# EAGLE design UPX_Port_Adapter (EAGLE 9.6.2)
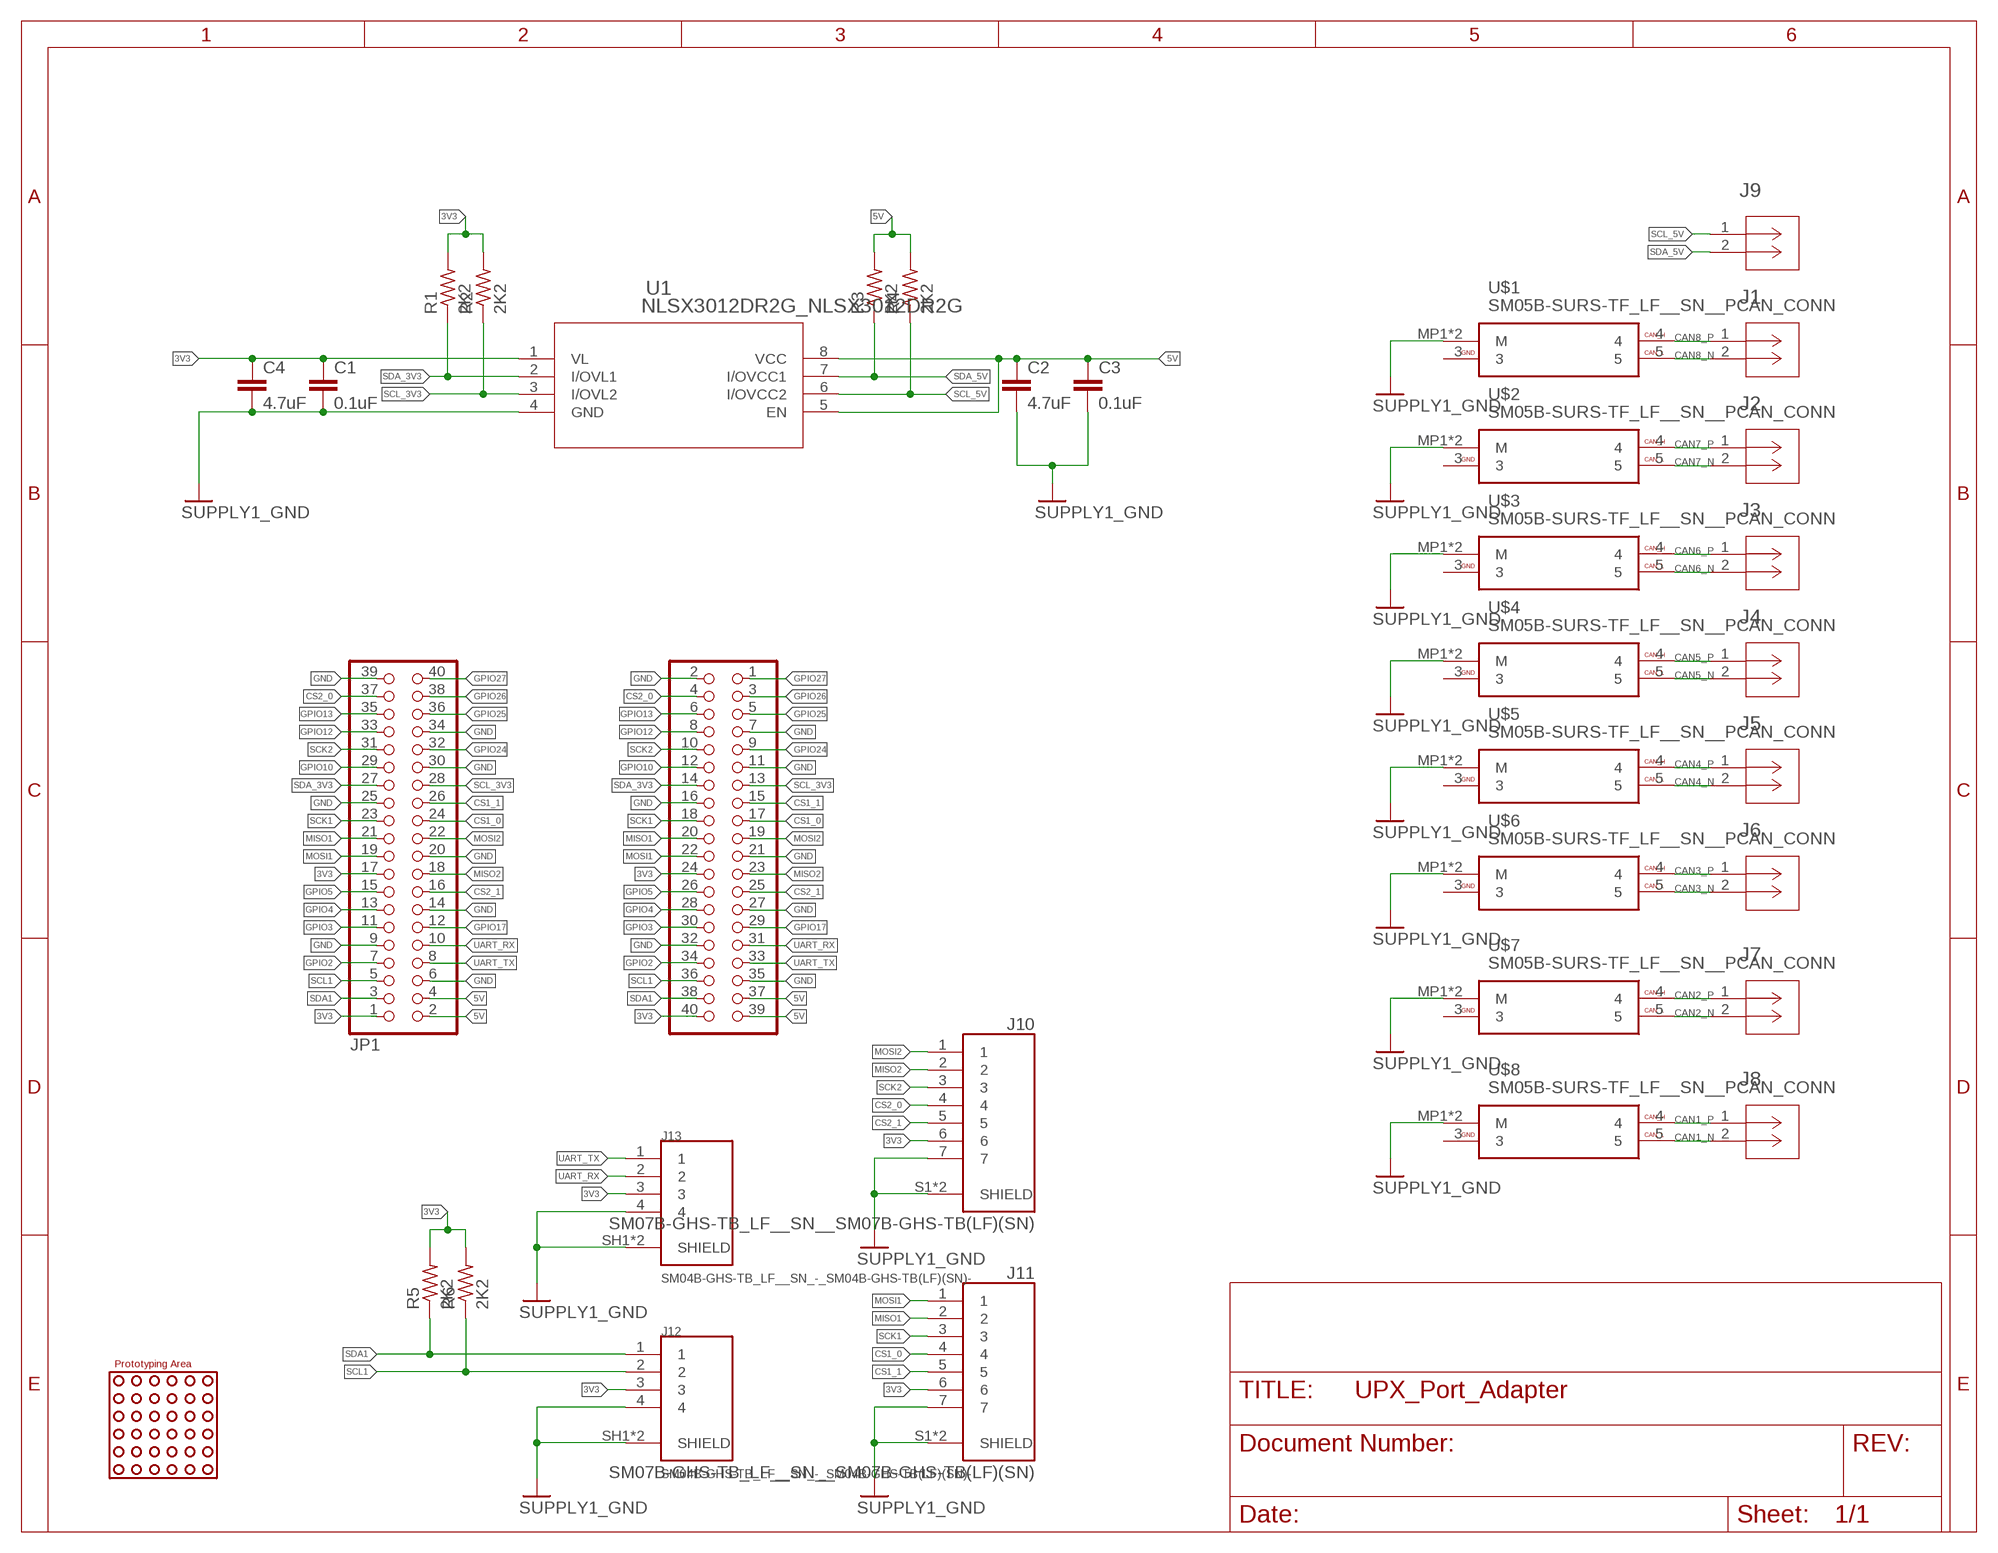
[diagram p0: schematic, sheet 1]

## Parts
C1  0.1uF  RCL_C-EUC0603  [RCL_C0603]
C2  4.7uF  RCL_C-EUC0603  [RCL_C0603]
C3  0.1uF  RCL_C-EUC0603  [RCL_C0603]
C4  4.7uF  RCL_C-EUC0603  [RCL_C0603]
J1  SM02B-GHS-TB_SM02BGHSTBLFSN  [SM02B-GHS-TB_CONN_SM02BGHSTB_JST]
J2  SM02B-GHS-TB_SM02BGHSTBLFSN  [SM02B-GHS-TB_CONN_SM02BGHSTB_JST]
J3  SM02B-GHS-TB_SM02BGHSTBLFSN  [SM02B-GHS-TB_CONN_SM02BGHSTB_JST]
J4  SM02B-GHS-TB_SM02BGHSTBLFSN  [SM02B-GHS-TB_CONN_SM02BGHSTB_JST]
J5  SM02B-GHS-TB_SM02BGHSTBLFSN  [SM02B-GHS-TB_CONN_SM02BGHSTB_JST]
J6  SM02B-GHS-TB_SM02BGHSTBLFSN  [SM02B-GHS-TB_CONN_SM02BGHSTB_JST]
J7  SM02B-GHS-TB_SM02BGHSTBLFSN  [SM02B-GHS-TB_CONN_SM02BGHSTB_JST]
J8  SM02B-GHS-TB_SM02BGHSTBLFSN  [SM02B-GHS-TB_CONN_SM02BGHSTB_JST]
J9  SM02B-GHS-TB_SM02BGHSTBLFSN  [SM02B-GHS-TB_CONN_SM02BGHSTB_JST]
J10  SM07B-GHS-TB_LF__SN__SM07B-GHS-TB(LF)(SN)  [SM07B-GHS-TB_LF__SN__JST_SM07B-GHS-TB(LF)(SN)]
J11  SM07B-GHS-TB_LF__SN__SM07B-GHS-TB(LF)(SN)  [SM07B-GHS-TB_LF__SN__JST_SM07B-GHS-TB(LF)(SN)]
J12  SM04B-GHS-TB_LF__SN_-_SM04B-GHS-TB(LF)(SN)-  [SM04B-GHS-TB_LF__SN_-_JST_SM04B-GHS-TB(LF)(SN)-]
J13  SM04B-GHS-TB_LF__SN_-_SM04B-GHS-TB(LF)(SN)-  [SM04B-GHS-TB_LF__SN_-_JST_SM04B-GHS-TB(LF)(SN)-]
JP1  PINHEAD_PINHD-2X20  [PINHEAD_2X20]
JP2  PINHEAD2_PINHD-2X20/90:1  [PINHEAD2_2X20/90]
R1  2K2  RCL_R-US_R0603  [RCL_R0603]
R2  2K2  RCL_R-US_R0603  [RCL_R0603]
R3  2K2  RCL_R-US_R0603  [RCL_R0603]
R4  2K2  RCL_R-US_R0603  [RCL_R0603]
R5  2K2  RCL_R-US_R0603  [RCL_R0603]
R6  2K2  RCL_R-US_R0603  [RCL_R0603]
U1  NLSX3012DR2G_NLSX3012DR2G  [NLSX3012DR2G_SOIC-8_NB_ONS]
U$1  SM05B-SURS-TF_LF__SN__PCAN_CONN  [SM05B-SURS-TF_LF__SN__SM05BSURSTFLFSN]
U$2  SM05B-SURS-TF_LF__SN__PCAN_CONN  [SM05B-SURS-TF_LF__SN__SM05BSURSTFLFSN]
U$3  SM05B-SURS-TF_LF__SN__PCAN_CONN  [SM05B-SURS-TF_LF__SN__SM05BSURSTFLFSN]
U$4  SM05B-SURS-TF_LF__SN__PCAN_CONN  [SM05B-SURS-TF_LF__SN__SM05BSURSTFLFSN]
U$5  SM05B-SURS-TF_LF__SN__PCAN_CONN  [SM05B-SURS-TF_LF__SN__SM05BSURSTFLFSN]
U$6  SM05B-SURS-TF_LF__SN__PCAN_CONN  [SM05B-SURS-TF_LF__SN__SM05BSURSTFLFSN]
U$7  SM05B-SURS-TF_LF__SN__PCAN_CONN  [SM05B-SURS-TF_LF__SN__SM05BSURSTFLFSN]
U$8  SM05B-SURS-TF_LF__SN__PCAN_CONN  [SM05B-SURS-TF_LF__SN__SM05BSURSTFLFSN]
U$9  PINHEAD-CUSTOM_20X20  [PINHEAD-CUSTOM_20X20]

## Nets
3V3: C1.1 C4.1 J10.6 J11.6 J12.3 J13.3 JP1.1 JP1.17 JP2.24 JP2.40 R1.2 R2.2 R5.2 R6.2 U1.1(VL)
5V: C2.1 C3.1 JP1.2 JP1.4 JP2.37 JP2.39 R3.2 R4.2 U1.5(EN) U1.8(VCC)
CAN1_N [CAN]: J8.2 U$8.5
CAN1_P [CAN]: J8.1 U$8.4
CAN2_N [CAN]: J7.2 U$7.5
CAN2_P [CAN]: J7.1 U$7.4
CAN3_N [CAN]: J6.2 U$6.5
CAN3_P [CAN]: J6.1 U$6.4
CAN4_N [CAN]: J5.2 U$5.5
CAN4_P [CAN]: J5.1 U$5.4
CAN5_N [CAN]: J4.2 U$4.5
CAN5_P [CAN]: J4.1 U$4.4
CAN6_N [CAN]: J3.2 U$3.5
CAN6_P [CAN]: J3.1 U$3.4
CAN7_N [CAN]: J2.2 U$2.5
CAN7_P [CAN]: J2.1 U$2.4
CAN8_N [CAN]: J1.2 U$1.5
CAN8_P [CAN]: J1.1 U$1.4
CS1_0: J11.4 JP1.24 JP2.17
CS1_1: J11.5 JP1.26 JP2.15
CS2_0: J10.4 JP1.37 JP2.4
CS2_1: J10.5 JP1.16 JP2.25
GND: C1.2 C2.2 C3.2 C4.2 J10.7 J10.S1(SHIELD) J10.S2(SHIELD) J11.7 J11.S1(SHIELD) J11.S2(SHIELD) J12.4 J12.SH1(SHIELD) J12.SH2(SHIELD) J13.4 J13.SH1(SHIELD) J13.SH2(SHIELD) JP1.6 JP1.9 JP1.14 JP1.20 JP1.25 JP1.30 JP1.34 JP1.39 JP2.2 JP2.7 JP2.11 JP2.16 JP2.21 JP2.27 JP2.32 JP2.35 U1.4(GND) U$1.MP1(M) U$1.MP2(M) U$2.MP1(M) U$2.MP2(M) U$3.MP1(M) U$3.MP2(M) U$4.MP1(M) U$4.MP2(M) U$5.MP1(M) U$5.MP2(M) U$6.MP1(M) U$6.MP2(M) U$7.MP1(M) U$7.MP2(M) U$8.MP1(M) U$8.MP2(M) ; supply symbol labelled SUPPLY1_GND
GPIO2: JP1.7 JP2.34
GPIO3: JP1.11 JP2.30
GPIO4: JP1.13 JP2.28
GPIO5: JP1.15 JP2.26
GPIO10: JP1.29 JP2.12
GPIO12: JP1.33 JP2.8
GPIO13: JP1.35 JP2.6
GPIO17: JP1.12 JP2.29
GPIO24: JP1.32 JP2.9
GPIO25: JP1.36 JP2.5
GPIO26: JP1.38 JP2.3
GPIO27: JP1.40 JP2.1
MISO1: J11.2 JP1.21 JP2.20
MISO2: J10.2 JP1.18 JP2.23
MOSI1: J11.1 JP1.19 JP2.22
MOSI2: J10.1 JP1.22 JP2.19
SCK1: J11.3 JP1.23 JP2.18
SCK2: J10.3 JP1.31 JP2.10
SCL1: J12.2 JP1.5 JP2.36 R6.1
SCL_3V3: JP1.28 JP2.13 R2.1 U1.3(I/OVL2)
SCL_5V: J9.1 R4.1 U1.6(I/OVCC2)
SDA1: J12.1 JP1.3 JP2.38 R5.1
SDA_3V3: JP1.27 JP2.14 R1.1 U1.2(I/OVL1)
SDA_5V: J9.2 R3.1 U1.7(I/OVCC1)
UART_RX: J13.2 JP1.10 JP2.31
UART_TX: J13.1 JP1.8 JP2.33
Unconnected: U$1.3 U$2.3 U$3.3 U$4.3 U$5.3 U$6.3 U$7.3 U$8.3

## Library data of the parts
C1-C4 = UPX_Port_Adapter:RCL_C-EU: CAPACITOR, European symbol; SPICEPREFIX: C
J1-J9 = UPX_Port_Adapter:SM02B-GHS-TB_SM02BGHSTBLFSN; COPYRIGHT: Copyright (C) 2022 Ultra Librarian. All rights reserved.; DIGI-KEY_PART_NUMBER_1: 455-1564-2-ND; DIGI-KEY_PART_NUMBER_2: 455-1564-1-ND; DIGI-KEY_PART_NUMBER_3: 455-1564-6-ND; MANUFACTURER_PART_NUMBER: SM02BGHSTBLFSN; MFR_NAME: JST
J10 J11 = UPX_Port_Adapter:SM07B-GHS-TB_LF__SN__SM07B-GHS-TB(LF)(SN): Conn Shrouded Header HDR 7 POS 1.25mm Solder RA SMD Reel; DESCRIPTION: Connector Header Surface Mount, Right Angle 7 position 0.049 (1.25mm); DIGI-KEY_PART_NUMBER: 455-1569-2-ND; MF: JST Sales; MP: SM07B-GHS-TB(LF)(SN); PACKAGE: None; PURCHASE-URL: https://pricing.snapeda.com/search/part/SM07B-GHS-TB(LF)(SN)/?ref=eda
J12 J13 = UPX_Port_Adapter:SM04B-GHS-TB_LF__SN_-_SM04B-GHS-TB(LF)(SN)-: Conn Header Gh Side 4pos 1.25mm; DESCRIPTION: Connector Header Surface Mount, Right Angle 4 position 0.049 (1.25mm); DIGI-KEY_PART_NUMBER: 455-1566-2-ND; MF: JST Sales; MP: SM04B-GHS-TB(LF)(SN)-; PACKAGE: None; PURCHASE-URL: https://pricing.snapeda.com/search/part/SM04B-GHS-TB(LF)(SN)-/?ref=eda
JP1 = UPX_Port_Adapter:PINHEAD_PINHD-2X20: PIN HEADER
JP2 = UPX_Port_Adapter:PINHEAD2_PINHD-2X20*?:1: PIN HEADER
R1-R6 = UPX_Port_Adapter:RCL_R-US_: RESISTOR, American symbol; SPICEPREFIX: R
U1 = UPX_Port_Adapter:NLSX3012DR2G_NLSX3012DR2G; COPYRIGHT: Copyright (C) 2022 Ultra Librarian. All rights reserved.; DIGI-KEY_PART_NUMBER_1: 2156-NLSX3012DR2G-OS-ND; DIGI-KEY_PART_NUMBER_2: NLSX3012DR2G-ND; DIGI-KEY_PART_NUMBER_3: NLSX3012DR2GOSCT-ND; DIGI-KEY_PART_NUMBER_4: NLSX3012DR2GOSDKR-ND; DIGI-KEY_PART_NUMBER_5: NLSX3012DR2GOSTR-ND; MANUFACTURER_PART_NUMBER: NLSX3012DR2G; MFR_NAME: onsemi
U$1-U$8 = UPX_Port_Adapter:SM05B-SURS-TF_LF__SN__PCAN_CONN
U$9 = UPX_Port_Adapter:PINHEAD-CUSTOM_20X20

## Net classes
1 CAN: width 0.152 mm, clearance 0.33 mm

## Board
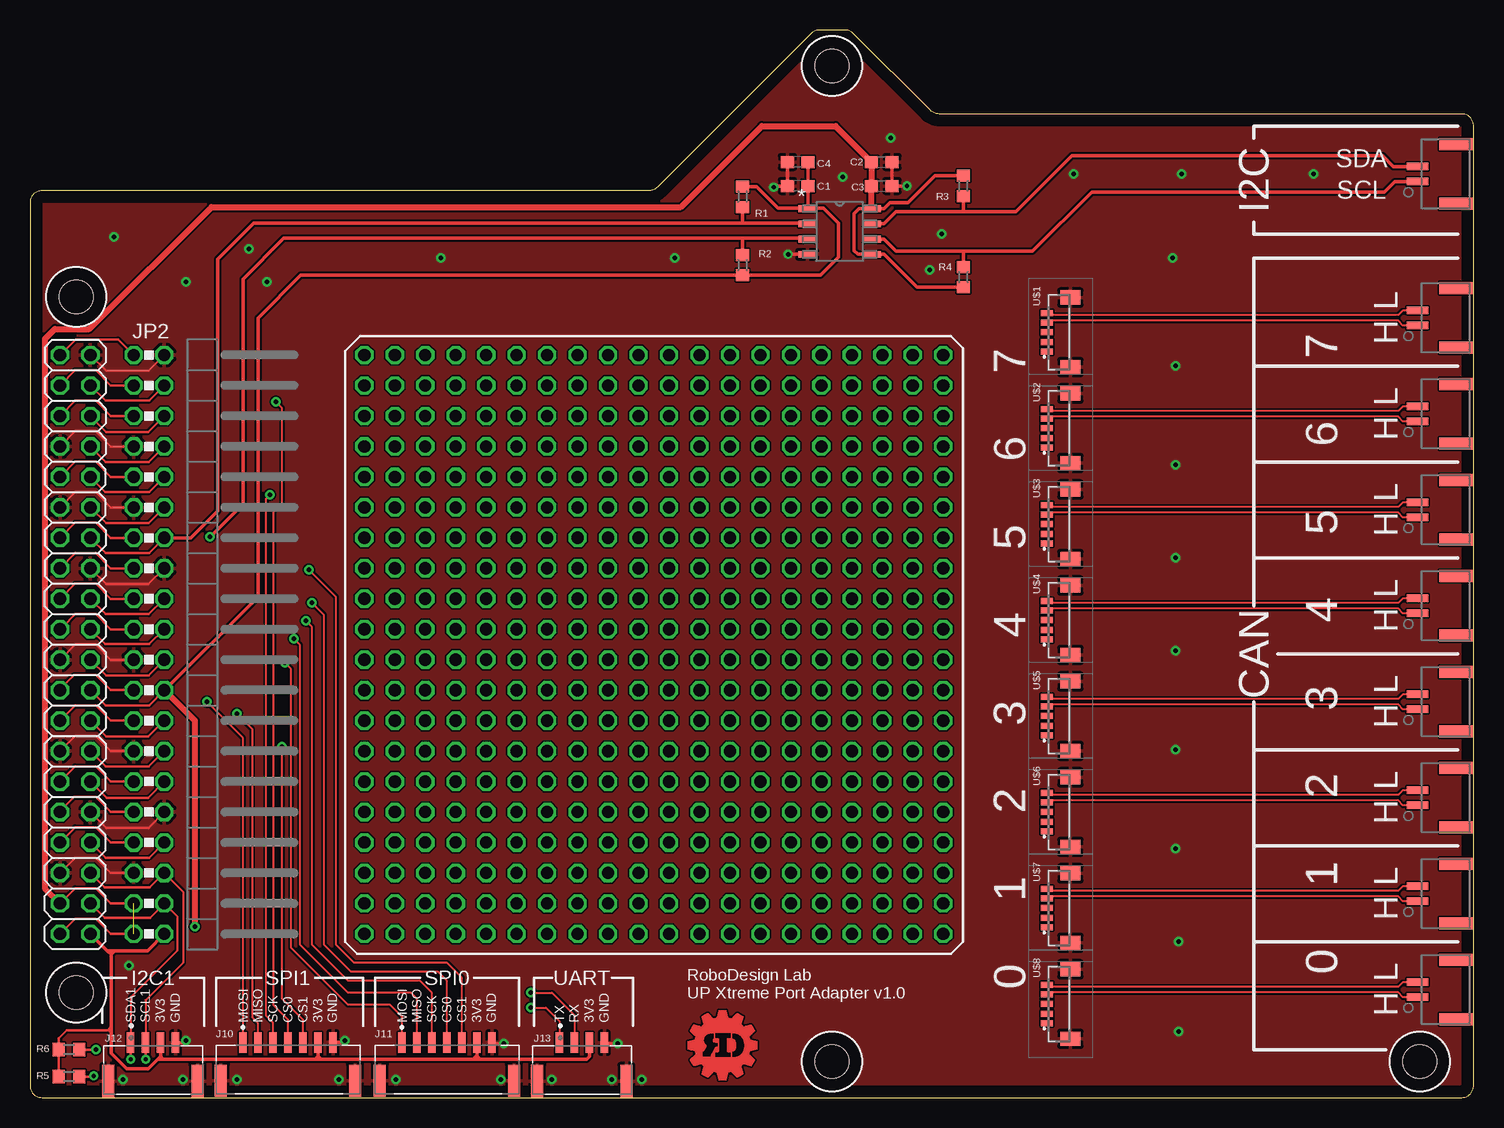
[diagram p1: board, top side]
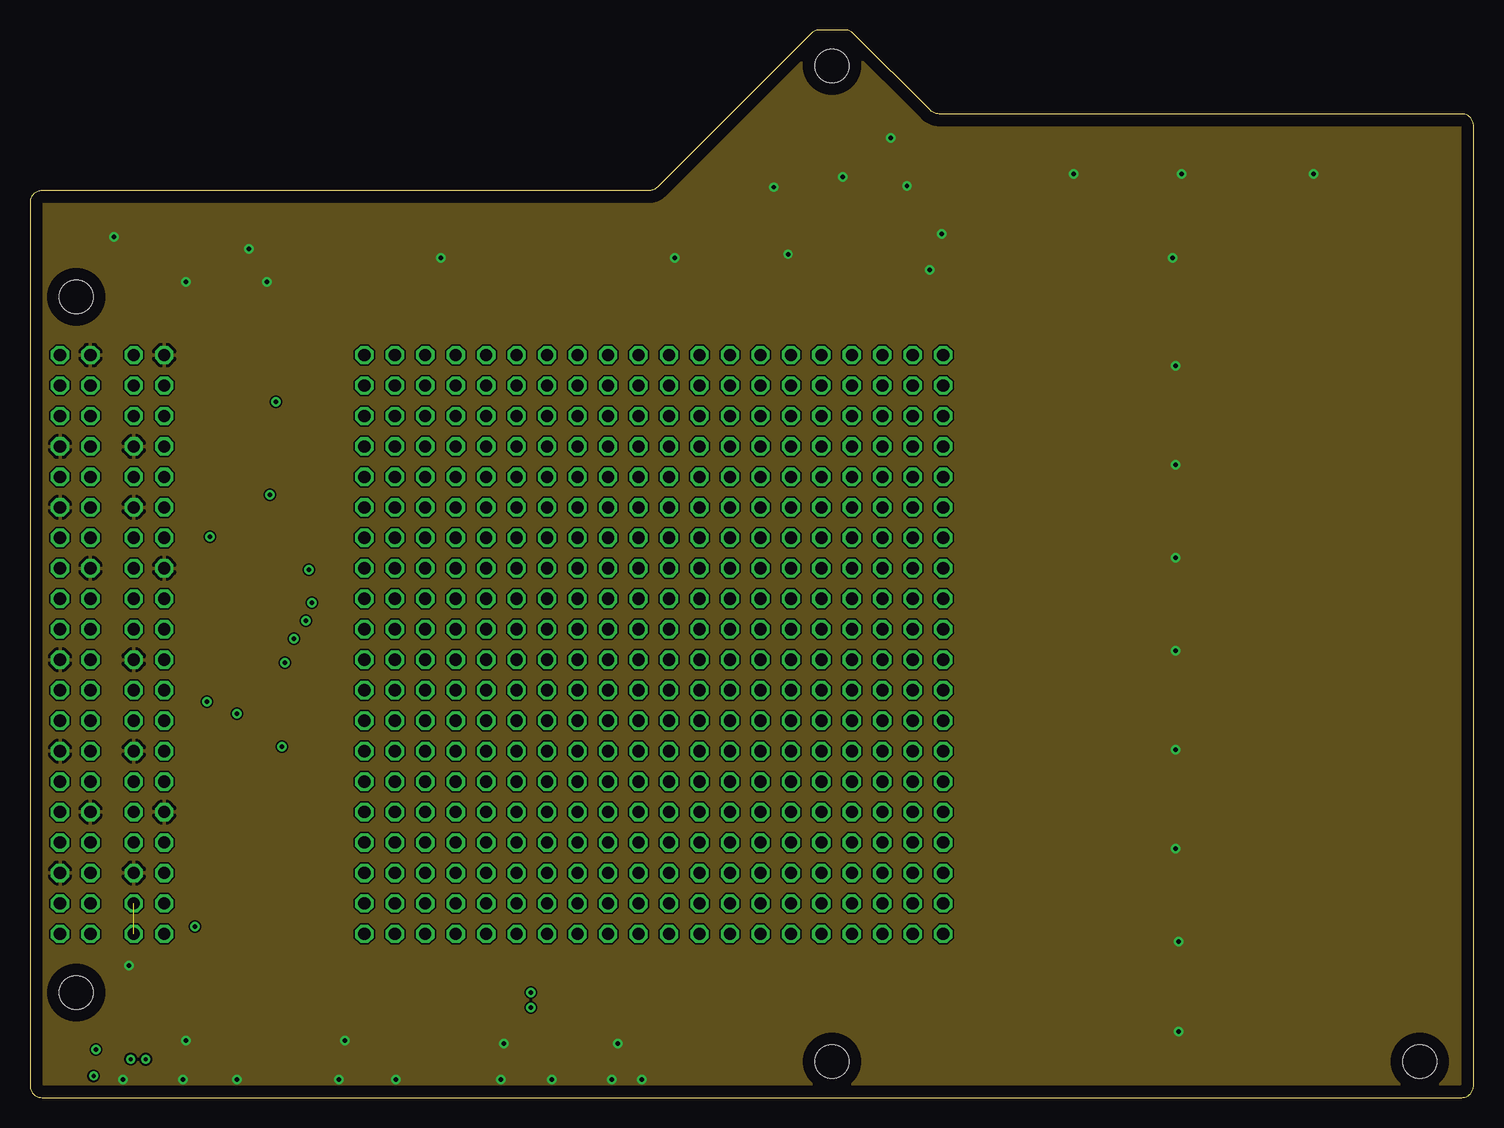
[diagram p2: board, inner layer Route2]
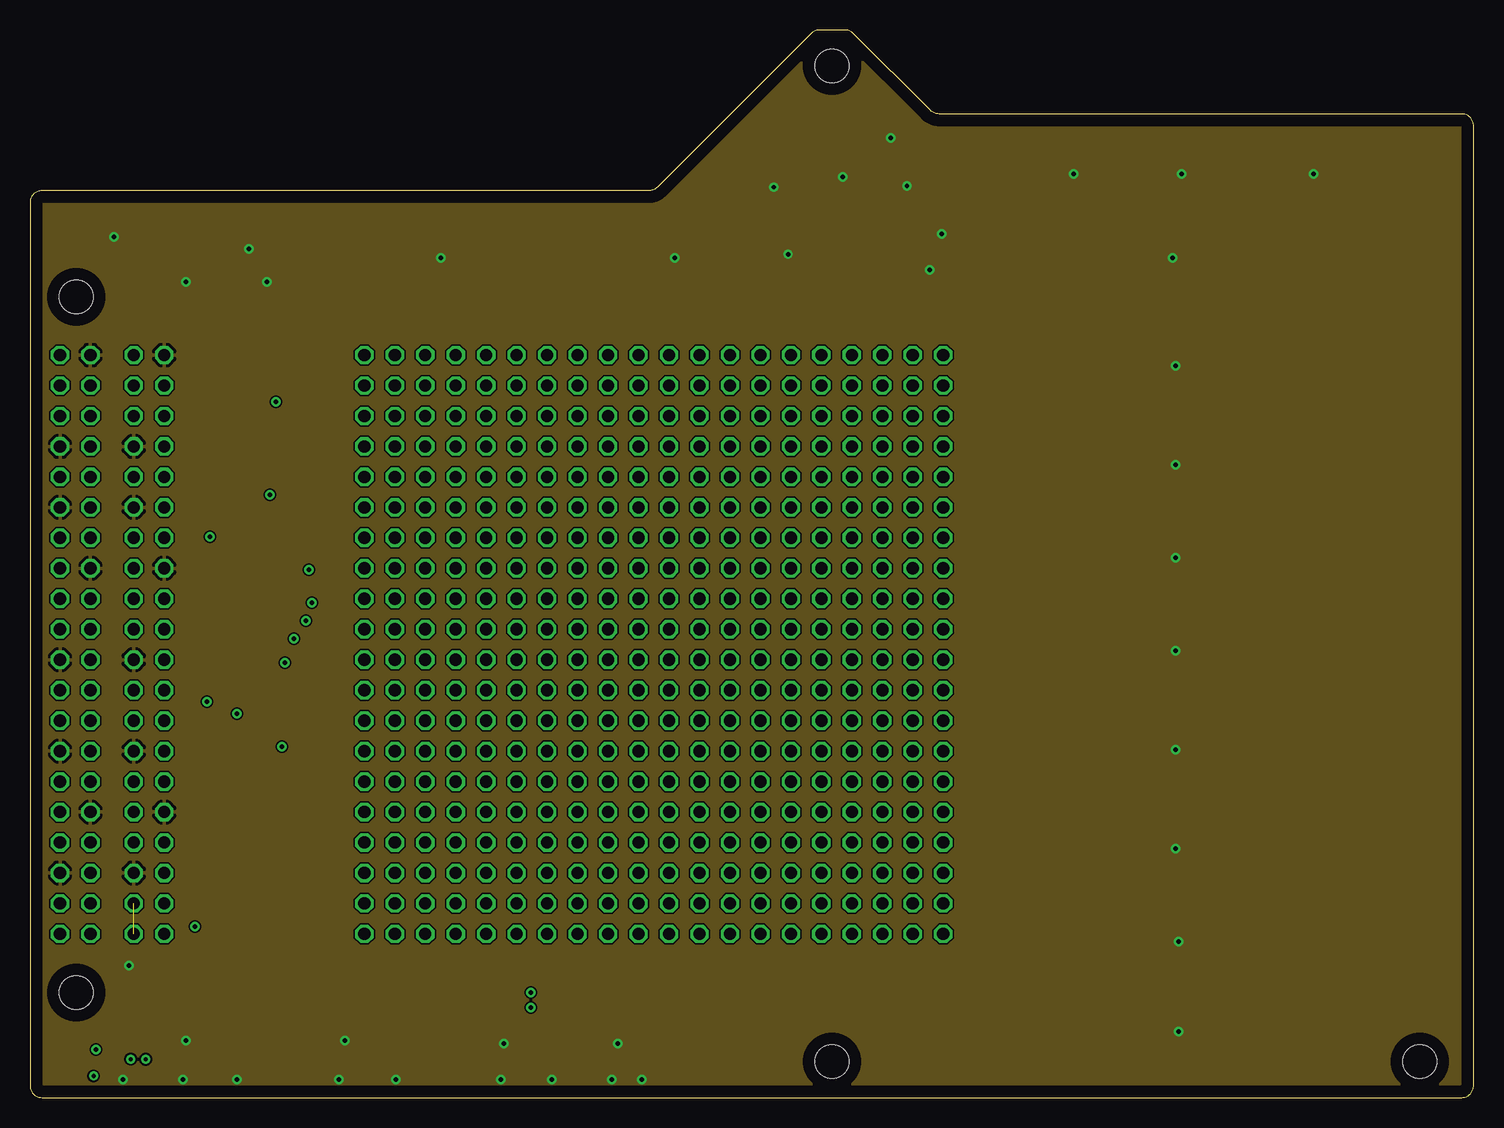
[diagram p3: board, inner layer Route15]
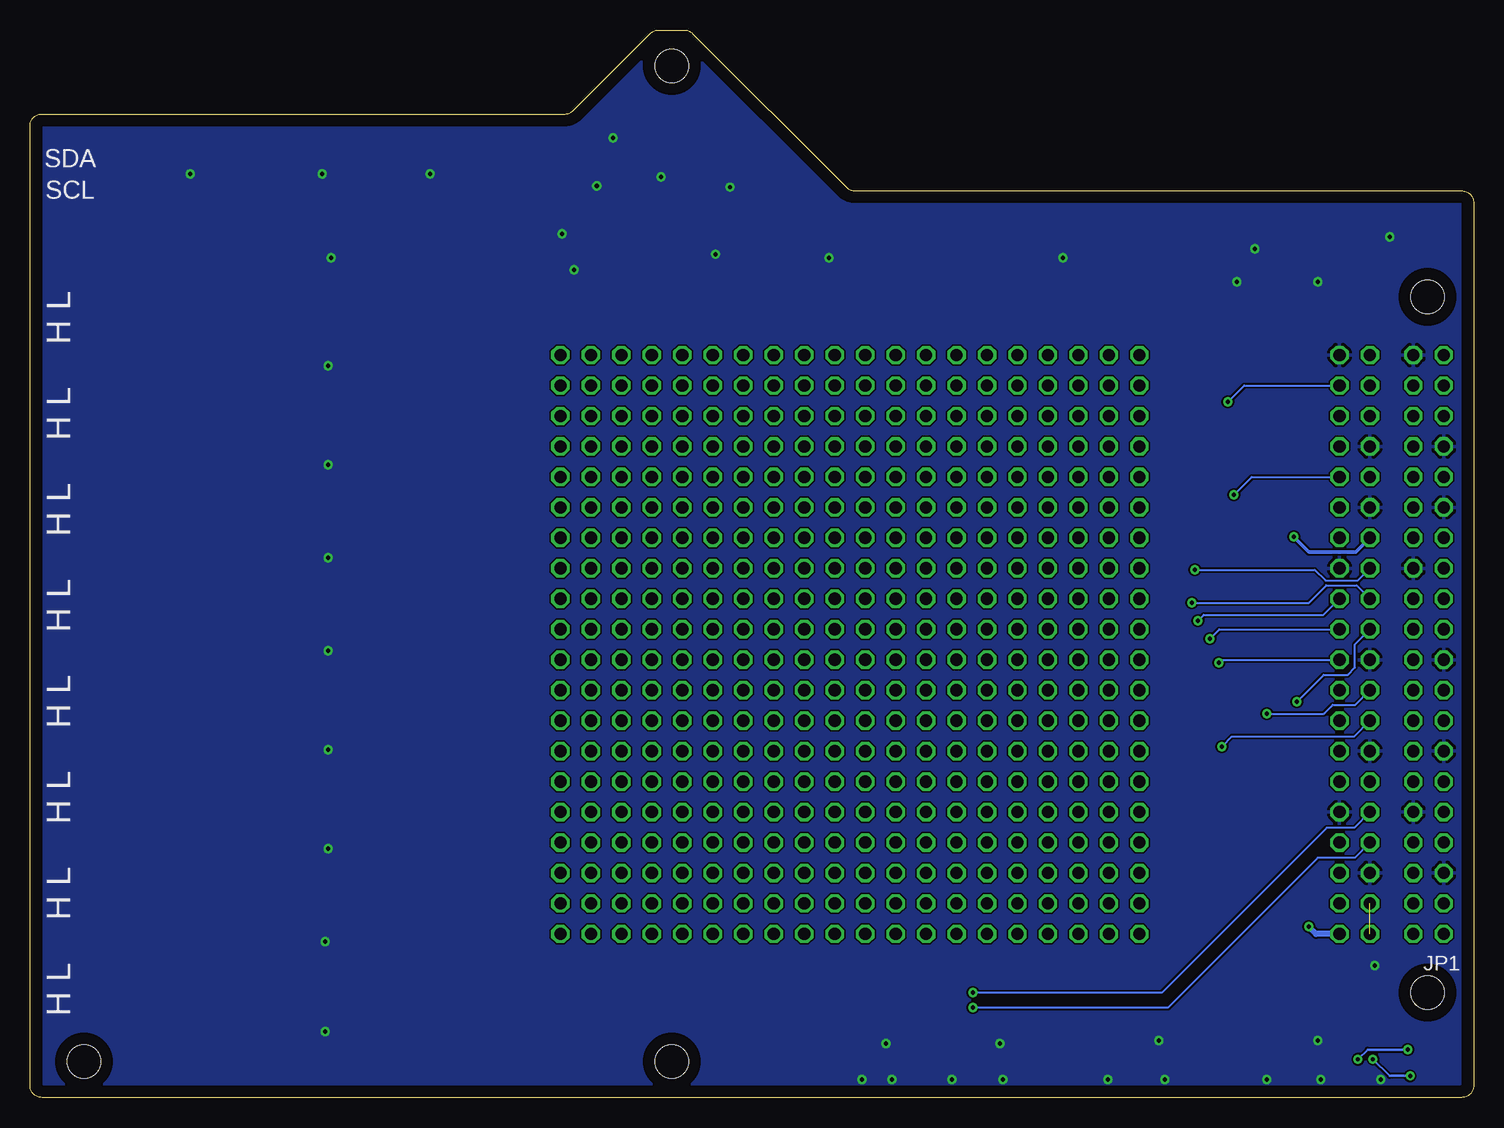
[diagram p4: board, bottom side, seen from below]

Size 120.35 x 89 mm. Coordinates in mm from the lower left corner, seen from the top.
Outline: 119.35,82 75.76,82 arc-45 75.06,82.29 68.64,88.71 arc45 67.94,89 65.81,89 arc45 65.11,88.71 52.29,75.89 arc-45 51.59,75.6 1,75.6 arc90 0,74.6 0,1 arc90 1,0 119.35,0 arc90 120.35,1 120.35,81 arc90 119.35,82
Copper layers (1+2*15+16): Top 0.035mm / dielectric 1.5mm / Route2 0.035mm / dielectric 0.15mm / Route15 0.035mm / dielectric 0.2mm / Bottom 0.035mm
Design rules "default *": minimum track width 6mil, minimum drill 0.35mm, track to track 6mil, track to pad 6mil, pad to pad 6mil, via to via 6mil, smd to smd 6mil, copper to edge 40mil, drill to drill 6mil, minimum pad ring 10mil, minimum via ring 8mil, stop-mask expansion 4mil, vias tented up to drill 20mil, thermal gap 10mil
Holes 2.8 mm at 3.85,8.75 3.85,66.75 115.85,3 66.85,3 66.85,86

### Footprints (pad centres in the part's own frame; a part is rotated, then mirrored left to right if it is on the bottom)
RCL_C0603 = smd 1.1 x 1: 1 -0.85,0; 2 0.85,0
SM02B-GHS-TB_CONN_SM02BGHSTB_JST = smd 0.66 x 1.803: 1 -0.625,2.345; 2 0.625,2.345 | smd 0.991 x 2.794: 3 -2.475,-0.865; 4 2.475,-0.865
SM07B-GHS-TB_LF__SN__JST_SM07B-GHS-TB(LF)(SN) = smd 0.6 x 1.7: 1 -3.75,1.85; 2 -2.5,1.85; 3 -1.25,1.85; 4 0,1.85; 5 1.25,1.85; 6 2.5,1.85; 7 3.75,1.85 | smd 1 x 2.7: S1 5.6,-1.35; S2 -5.6,-1.35
SM04B-GHS-TB_LF__SN_-_JST_SM04B-GHS-TB(LF)(SN)- = smd 0.6 x 1.7: 1 -1.875,2.275; 2 -0.625,2.275; 3 0.625,2.275; 4 1.875,2.275 | smd 1 x 2.7: SH1 -3.725,-0.925; SH2 3.725,-0.925
PINHEAD_2X20 = drill 1.016 octagon: 1 -24.13,-1.27; 2 -24.13,1.27; 3 -21.59,-1.27; 4 -21.59,1.27; 5 -19.05,-1.27; 6 -19.05,1.27; 7 -16.51,-1.27; 8 -16.51,1.27; 9 -13.97,-1.27; 10 -13.97,1.27; 11 -11.43,-1.27; 12 -11.43,1.27; 13 -8.89,-1.27; 14 -8.89,1.27; 15 -6.35,-1.27; 16 -6.35,1.27; 17 -3.81,-1.27; 18 -3.81,1.27; 19 -1.27,-1.27; 20 -1.27,1.27; 21 1.27,-1.27; 22 1.27,1.27; 23 3.81,-1.27; 24 3.81,1.27; 25 6.35,-1.27; 26 6.35,1.27; 27 8.89,-1.27; 28 8.89,1.27; 29 11.43,-1.27; 30 11.43,1.27; 31 13.97,-1.27; 32 13.97,1.27; 33 16.51,-1.27; 34 16.51,1.27; 35 19.05,-1.27; 36 19.05,1.27; 37 21.59,-1.27; 38 21.59,1.27; 39 24.13,-1.27; 40 24.13,1.27
PINHEAD2_2X20/90 = drill 1.016 octagon: 1 -24.13,-6.35; 2 -24.13,-3.81; 3 -21.59,-6.35; 4 -21.59,-3.81; 5 -19.05,-6.35; 6 -19.05,-3.81; 7 -16.51,-6.35; 8 -16.51,-3.81; 9 -13.97,-6.35; 10 -13.97,-3.81; 11 -11.43,-6.35; 12 -11.43,-3.81; 13 -8.89,-6.35; 14 -8.89,-3.81; 15 -6.35,-6.35; 16 -6.35,-3.81; 17 -3.81,-6.35; 18 -3.81,-3.81; 19 -1.27,-6.35; 20 -1.27,-3.81; 21 1.27,-6.35; 22 1.27,-3.81; 23 3.81,-6.35; 24 3.81,-3.81; 25 6.35,-6.35; 26 6.35,-3.81; 27 8.89,-6.35; 28 8.89,-3.81; 29 11.43,-6.35; 30 11.43,-3.81; 31 13.97,-6.35; 32 13.97,-3.81; 33 16.51,-6.35; 34 16.51,-3.81; 35 19.05,-6.35; 36 19.05,-3.81; 37 21.59,-6.35; 38 21.59,-3.81; 39 24.13,-6.35; 40 24.13,-3.81
RCL_R0603 = smd 1 x 1.1: 1 -0.85,0; 2 0.85,0
NLSX3012DR2G_SOIC-8_NB_ONS = smd 1.493 x 0.558: 1 -2.702,1.905; 2 -2.702,0.635; 3 -2.702,-0.635; 4 -2.702,-1.905; 5 2.702,-1.905; 6 2.702,-0.635; 7 2.702,0.635; 8 2.702,1.905
SM05B-SURS-TF_LF__SN__SM05BSURSTFLFSN = smd 0.5 x 1: 1 -1.6,0.975; 2 -0.8,0.975; 3 0,0.975; 4 0.8,0.975; 5 1.6,0.975 | smd 1.2 x 1.7: MP1 2.9,-0.975; MP2 -2.9,-0.975
PINHEAD-CUSTOM_20X20 = drill 1.016 octagon: 1 -24.13,1.27; 2 -24.13,3.81; 3 -21.59,1.27; 4 -21.59,3.81; 5 -19.05,1.27; 6 -19.05,3.81; 7 -16.51,1.27; 8 -16.51,3.81; 9 -13.97,1.27; 10 -13.97,3.81; 11 -11.43,1.27; 12 -11.43,3.81; 13 -8.89,1.27; 14 -8.89,3.81; 15 -6.35,1.27; 16 -6.35,3.81; 17 -3.81,1.27; 18 -3.81,3.81; 19 -1.27,1.27; 20 -1.27,3.81; 21 1.27,1.27; 22 1.27,3.81; 23 3.81,1.27; 24 3.81,3.81; 25 6.35,1.27; 26 6.35,3.81; 27 8.89,1.27; 28 8.89,3.81; 29 11.43,1.27; 30 11.43,3.81; 31 13.97,1.27; 32 13.97,3.81; 33 16.51,1.27; 34 16.51,3.81; 35 19.05,1.27; 36 19.05,3.81; 37 21.59,1.27; 38 21.59,3.81; 39 24.13,1.27; 40 24.13,3.81; 41 -24.13,6.35; 42 -24.13,8.89; 43 -21.59,6.35; 44 -21.59,8.89; 45 -19.05,6.35; 46 -19.05,8.89; 47 -16.51,6.35; 48 -16.51,8.89; 49 -13.97,6.35; 50 -13.97,8.89; 51 -11.43,6.35; 52 -11.43,8.89; 53 -8.89,6.35; 54 -8.89,8.89; 55 -6.35,6.35; 56 -6.35,8.89; 57 -3.81,6.35; 58 -3.81,8.89; 59 -1.27,6.35; 60 -1.27,8.89; 61 1.27,6.35; 62 1.27,8.89; 63 3.81,6.35; 64 3.81,8.89; 65 6.35,6.35; 66 6.35,8.89; 67 8.89,6.35; 68 8.89,8.89; 69 11.43,6.35; 70 11.43,8.89; 71 13.97,6.35; 72 13.97,8.89; 73 16.51,6.35; 74 16.51,8.89; 75 19.05,6.35; 76 19.05,8.89; 77 21.59,6.35; 78 21.59,8.89; 79 24.13,6.35; 80 24.13,8.89; 81 -24.13,11.43; 82 -24.13,13.97; 83 -21.59,11.43; 84 -21.59,13.97; 85 -19.05,11.43; 86 -19.05,13.97; 87 -16.51,11.43; 88 -16.51,13.97; 89 -13.97,11.43; 90 -13.97,13.97; 91 -11.43,11.43; 92 -11.43,13.97; 93 -8.89,11.43; 94 -8.89,13.97; 95 -6.35,11.43; 96 -6.35,13.97; 97 -3.81,11.43; 98 -3.81,13.97; 99 -1.27,11.43; 100 -1.27,13.97; 101 1.27,11.43; 102 1.27,13.97; 103 3.81,11.43; 104 3.81,13.97; 105 6.35,11.43; 106 6.35,13.97; 107 8.89,11.43; 108 8.89,13.97; 109 11.43,11.43; 110 11.43,13.97; 111 13.97,11.43; 112 13.97,13.97; 113 16.51,11.43; 114 16.51,13.97; 115 19.05,11.43; 116 19.05,13.97; 117 21.59,11.43; 118 21.59,13.97; 119 24.13,11.43; 120 24.13,13.97; 121 -24.13,-3.81; 122 -24.13,-1.27; 123 -21.59,-3.81; 124 -21.59,-1.27; 125 -19.05,-3.81; 126 -19.05,-1.27; 127 -16.51,-3.81; 128 -16.51,-1.27; 129 -13.97,-3.81; 130 -13.97,-1.27; 131 -11.43,-3.81; 132 -11.43,-1.27; 133 -8.89,-3.81; 134 -8.89,-1.27; 135 -6.35,-3.81; 136 -6.35,-1.27; 137 -3.81,-3.81; 138 -3.81,-1.27; 139 -1.27,-3.81; 140 -1.27,-1.27; 141 1.27,-3.81; 142 1.27,-1.27; 143 3.81,-3.81; 144 3.81,-1.27; 145 6.35,-3.81; 146 6.35,-1.27; 147 8.89,-3.81; 148 8.89,-1.27; 149 11.43,-3.81; 150 11.43,-1.27; 151 13.97,-3.81; 152 13.97,-1.27; 153 16.51,-3.81; 154 16.51,-1.27; 155 19.05,-3.81; 156 19.05,-1.27; 157 21.59,-3.81; 158 21.59,-1.27; 159 24.13,-3.81; 160 24.13,-1.27; 161 -24.13,-8.89; 162 -24.13,-6.35; 163 -21.59,-8.89; 164 -21.59,-6.35; 165 -19.05,-8.89; 166 -19.05,-6.35; 167 -16.51,-8.89; 168 -16.51,-6.35; 169 -13.97,-8.89; 170 -13.97,-6.35; 171 -11.43,-8.89; 172 -11.43,-6.35; 173 -8.89,-8.89; 174 -8.89,-6.35; 175 -6.35,-8.89; 176 -6.35,-6.35; 177 -3.81,-8.89; 178 -3.81,-6.35; 179 -1.27,-8.89; 180 -1.27,-6.35; 181 1.27,-8.89; 182 1.27,-6.35; 183 3.81,-8.89; 184 3.81,-6.35; 185 6.35,-8.89; 186 6.35,-6.35; 187 8.89,-8.89; 188 8.89,-6.35; 189 11.43,-8.89; 190 11.43,-6.35; 191 13.97,-8.89; 192 13.97,-6.35; 193 16.51,-8.89; 194 16.51,-6.35; 195 19.05,-8.89; 196 19.05,-6.35; 197 21.59,-8.89; 198 21.59,-6.35; 199 24.13,-8.89; 200 24.13,-6.35; 201 -24.13,16.51; 202 -24.13,19.05; 203 -21.59,16.51; 204 -21.59,19.05; 205 -19.05,16.51; 206 -19.05,19.05; 207 -16.51,16.51; 208 -16.51,19.05; 209 -13.97,16.51; 210 -13.97,19.05; 211 -11.43,16.51; 212 -11.43,19.05; 213 -8.89,16.51; 214 -8.89,19.05; 215 -6.35,16.51; 216 -6.35,19.05; 217 -3.81,16.51; 218 -3.81,19.05; 219 -1.27,16.51; 220 -1.27,19.05; 221 1.27,16.51; 222 1.27,19.05; 223 3.81,16.51; 224 3.81,19.05; 225 6.35,16.51; 226 6.35,19.05; 227 8.89,16.51; 228 8.89,19.05; 229 11.43,16.51; 230 11.43,19.05; 231 13.97,16.51; 232 13.97,19.05; 233 16.51,16.51; 234 16.51,19.05; 235 19.05,16.51; 236 19.05,19.05; 237 21.59,16.51; 238 21.59,19.05; 239 24.13,16.51; 240 24.13,19.05; 241 -24.13,-13.97; 242 -24.13,-11.43; 243 -21.59,-13.97; 244 -21.59,-11.43; 245 -19.05,-13.97; 246 -19.05,-11.43; 247 -16.51,-13.97; 248 -16.51,-11.43; 249 -13.97,-13.97; 250 -13.97,-11.43; 251 -11.43,-13.97; 252 -11.43,-11.43; 253 -8.89,-13.97; 254 -8.89,-11.43; 255 -6.35,-13.97; 256 -6.35,-11.43; 257 -3.81,-13.97; 258 -3.81,-11.43; 259 -1.27,-13.97; 260 -1.27,-11.43; 261 1.27,-13.97; 262 1.27,-11.43; 263 3.81,-13.97; 264 3.81,-11.43; 265 6.35,-13.97; 266 6.35,-11.43; 267 8.89,-13.97; 268 8.89,-11.43; 269 11.43,-13.97; 270 11.43,-11.43; 271 13.97,-13.97; 272 13.97,-11.43; 273 16.51,-13.97; 274 16.51,-11.43; 275 19.05,-13.97; 276 19.05,-11.43; 277 21.59,-13.97; 278 21.59,-11.43; 279 24.13,-13.97; 280 24.13,-11.43; 281 -24.13,21.59; 282 -24.13,24.13; 283 -21.59,21.59; 284 -21.59,24.13; 285 -19.05,21.59; 286 -19.05,24.13; 287 -16.51,21.59; 288 -16.51,24.13; 289 -13.97,21.59; 290 -13.97,24.13; 291 -11.43,21.59; 292 -11.43,24.13; 293 -8.89,21.59; 294 -8.89,24.13; 295 -6.35,21.59; 296 -6.35,24.13; 297 -3.81,21.59; 298 -3.81,24.13; 299 -1.27,21.59; 300 -1.27,24.13; 301 1.27,21.59; 302 1.27,24.13; 303 3.81,21.59; 304 3.81,24.13; 305 6.35,21.59; 306 6.35,24.13; 307 8.89,21.59; 308 8.89,24.13; 309 11.43,21.59; 310 11.43,24.13; 311 13.97,21.59; 312 13.97,24.13; 313 16.51,21.59; 314 16.51,24.13; 315 19.05,21.59; 316 19.05,24.13; 317 21.59,21.59; 318 21.59,24.13; 319 24.13,21.59; 320 24.13,24.13; 321 -24.13,-19.05; 322 -24.13,-16.51; 323 -21.59,-19.05; 324 -21.59,-16.51; 325 -19.05,-19.05; 326 -19.05,-16.51; 327 -16.51,-19.05; 328 -16.51,-16.51; 329 -13.97,-19.05; 330 -13.97,-16.51; 331 -11.43,-19.05; 332 -11.43,-16.51; 333 -8.89,-19.05; 334 -8.89,-16.51; 335 -6.35,-19.05; 336 -6.35,-16.51; 337 -3.81,-19.05; 338 -3.81,-16.51; 339 -1.27,-19.05; 340 -1.27,-16.51; 341 1.27,-19.05; 342 1.27,-16.51; 343 3.81,-19.05; 344 3.81,-16.51; 345 6.35,-19.05; 346 6.35,-16.51; 347 8.89,-19.05; 348 8.89,-16.51; 349 11.43,-19.05; 350 11.43,-16.51; 351 13.97,-19.05; 352 13.97,-16.51; 353 16.51,-19.05; 354 16.51,-16.51; 355 19.05,-19.05; 356 19.05,-16.51; 357 21.59,-19.05; 358 21.59,-16.51; 359 24.13,-19.05; 360 24.13,-16.51; 361 -24.13,-24.13; 362 -24.13,-21.59; 363 -21.59,-24.13; 364 -21.59,-21.59; 365 -19.05,-24.13; 366 -19.05,-21.59; 367 -16.51,-24.13; 368 -16.51,-21.59; 369 -13.97,-24.13; 370 -13.97,-21.59; 371 -11.43,-24.13; 372 -11.43,-21.59; 373 -8.89,-24.13; 374 -8.89,-21.59; 375 -6.35,-24.13; 376 -6.35,-21.59; 377 -3.81,-24.13; 378 -3.81,-21.59; 379 -1.27,-24.13; 380 -1.27,-21.59; 381 1.27,-24.13; 382 1.27,-21.59; 383 3.81,-24.13; 384 3.81,-21.59; 385 6.35,-24.13; 386 6.35,-21.59; 387 8.89,-24.13; 388 8.89,-21.59; 389 11.43,-24.13; 390 11.43,-21.59; 391 13.97,-24.13; 392 13.97,-21.59; 393 16.51,-24.13; 394 16.51,-21.59; 395 19.05,-24.13; 396 19.05,-21.59; 397 21.59,-24.13; 398 21.59,-21.59; 399 24.13,-24.13; 400 24.13,-21.59

### Placement (x,y rotation side)
C1  64,76 180 top
C2  71,78 0 top
C3  71,76 0 top
C4  64,78 180 top
J1  118,65 90 top
J2  118,57 90 top
J3  118,49 90 top
J4  118,41 90 top
J5  118,33 90 top
J6  118,25 90 top
J7  118,17 90 top
J8  118,9 90 top
J9  118,77 90 top
J10  21.5,2.75 0 top
J11  34.75,2.75 0 top
J12  10.25,2.3 0 top
J13  46,2.3 0 top
JP1  3.77,37.77 90 top
JP2  15,37.77 270 top
R1  59.4,75.1 90 top
R2  59.4,69.4 270 top
R3  77.8,76 90 top
R4  77.8,68.4 270 top
R5  3.25,1.75 180 top
R6  3.25,4 180 top
U1  67.5,72.2 0 top
U$1  85.75,63.8 90 top
U$2  85.75,55.8 90 top
U$3  85.75,47.8 90 top
U$4  85.75,39.8 90 top
U$5  85.75,31.8 90 top
U$6  85.75,23.8 90 top
U$7  85.75,15.8 90 top
U$8  85.75,7.8 90 top
U$9  52,37.77 0 top

### Tracks (layer width: path | path; a pad name or v marks a point on that pad's centre or on a via)
3V3  (via drill 0.35)
  Top 0.203: JP1.17 6.3,32.7 9.93,32.7 JP2.24 | R5.2 R6.2 2.4,4.95 3.05,5.6 6.5,5.6 | 6.5,5.6 6.75,5.6 | 6.5,5.6 6.7,5.8 6.75,5.8 | 6.5,5.6 6.75,5.35
  Top 0.305: C4.1 C1.1 64.85,74.16 | 64.85,74.16 U1.1 | 64.85,74.16 66.14,74.16 67.4,72.9 67.4,70.05 65.9,68.55 R2.2 22.55,68.55 19,65 19,41.75 11.21,33.96 JP2.24 | R1.2 60.55,75.95 62.34,74.16 64.85,74.16 | JP1.1 6.43,12.25 | JP2.40 9.8,12.25 7.07,12.25 | 6.43,12.25 7.07,12.25 | J12.3 10.88,3.42 | 10.88,3.42 11.1,3.2 | 6.43,12.25 6.75,11.93 | 10.65,3.2 11.1,3.2 | 6.75,11.93 6.75,5.8 6.75,5.6 6.75,5.35 6.75,3.7 8.05,2.4 9.85,2.4 10.65,3.2 | 10.88,3.42 10.65,3.2 | 6.75,11.93 7.07,12.25 | 36.95,3.2 37.23,3.48 | 37.23,3.48 37.25,3.5 J11.6 | 11.1,3.2 23.75,3.2 | 23.75,3.2 24,3.2 | 24,3.2 24.25,3.2 | 24.25,3.2 36.95,3.2 | J10.6 24,3.45 | 24,3.45 24,3.2 | 23.75,3.2 24,3.45 | 24,3.45 24.25,3.2 | J13.3 46.62,3.42 46.4,3.2 37.5,3.2 | 37.23,3.48 37.5,3.2 | 37.5,3.2 36.95,3.2
  Top 0.508: v13.75,14.25 13.75,31.4 JP2.24
  Bottom 0.508: JP2.40 13.14,13.64 v13.75,14.25
5V  (1 unrouted)
  Top 0.203: JP1.4 3.77,17.45 5.46,17.45 6.73,16.18 JP2.37 | JP1.2 3.77,14.91 5.46,14.91 6.73,13.64 JP2.39
  Top 0.305: R4.2 73.95,67.55 71.2,70.3 U1.5 69,70.3 68.7,70.6 68.7,73.7 69.11,74.11 U1.8 71.2,74.11 71.7,74.6 73.2,74.6 75.45,76.85 R3.2
  Top 0.508: JP1.4 1.27,17.41 1.27,63.27 2.08,64.08 4.96,64.08 15.13,74.25 54.25,74.25 61,81 67.15,81 C2.1 C3.1 70.15,74.16 U1.8
CAN1_N
  Top 0.152: J8.2 114.45,9.62 114.06,9.24 84.93,9.24 U$8.5
CAN1_P
  Top 0.152: J8.1 114.45,8.38 114.06,8.76 84.93,8.76 U$8.4
CAN2_N
  Top 0.152: J7.2 114.45,17.62 114.06,17.24 84.93,17.24 U$7.5
CAN2_P
  Top 0.152: J7.1 114.45,16.38 114.06,16.76 84.93,16.76 U$7.4
CAN3_N
  Top 0.152: J6.2 114.45,25.62 114.06,25.24 84.93,25.24 U$6.5
CAN3_P
  Top 0.152: J6.1 114.45,24.38 114.06,24.76 84.93,24.76 U$6.4
CAN4_N
  Top 0.152: J5.2 114.45,33.62 114.06,33.24 84.93,33.24 U$5.5
CAN4_P
  Top 0.152: J5.1 114.45,32.38 114.06,32.76 84.93,32.76 U$5.4
CAN5_N
  Top 0.152: J4.2 114.45,41.62 114.06,41.24 84.93,41.24 U$4.5
CAN5_P
  Top 0.152: J4.1 114.45,40.38 114.06,40.76 84.93,40.76 U$4.4
CAN6_N
  Top 0.152: J3.2 114.45,49.62 114.06,49.24 84.93,49.24 U$3.5
CAN6_P
  Top 0.152: J3.1 114.45,48.38 114.06,48.76 84.93,48.76 U$3.4
CAN7_N
  Top 0.152: J2.2 114.45,57.62 114.06,57.24 84.93,57.24 U$2.5
CAN7_P
  Top 0.152: J2.1 114.45,56.38 114.06,56.76 84.93,56.76 U$2.4
CAN8_N
  Top 0.152: J1.2 114.45,65.62 114.06,65.24 84.93,65.24 U$1.5
CAN8_P
  Top 0.152: J1.1 114.45,64.38 114.06,64.76 84.93,64.76 U$1.4
CS1_0  (via drill 0.35)
  Top 0.152: J11.4 34.75,9.75 34,10.5 26.75,10.5 24.5,12.75 24.5,40.25 v23.5,41.25
  Top 0.203: JP1.24 3.77,42.85 5.46,42.85 6.73,41.58 JP2.17
  Bottom 0.152: v23.5,41.25 13.75,41.25 12.3,42.7 9.77,42.7 JP2.17
CS1_1  (via drill 0.35)
  Top 0.152: J11.5 36,10 34.75,11.25 27,11.25 25.5,12.75 25.5,41.75 v23.25,44
  Top 0.203: JP1.26 3.77,45.39 5.46,45.39 6.73,44.12 JP2.15
  Bottom 0.152: v23.25,44 13.25,44 12.35,43.1 9.67,43.1 JP2.15
CS2_0  (via drill 0.35)
  Top 0.152: J10.4 21.5,6.5 20.3,7.7 20.3,48.8 21,49.5 21,57.5 v20.5,58
  Top 0.203: JP1.37 6.3,58.1 9.93,58.1 JP2.4
  Bottom 0.152: v20.5,58 19.14,59.36 JP2.4
CS2_1  (via drill 0.35)
  Top 0.152: J10.5 22.75,6.5 21,8.25 v21,29.25
  Top 0.203: JP1.16 3.77,32.69 5.46,32.69 6.73,31.42 JP2.25
  Bottom 0.152: v21,29.25 20.15,30.1 9.97,30.1 JP2.25
GND  (via drill 0.35)
  Top 0.203: JP1.9 6.34,22.5 9.89,22.5 JP2.32 | JP1.25 6.36,42.8 9.87,42.8 JP2.16 | JP1.39 6.34,60.6 9.89,60.6 JP2.2 | JP1.34 3.77,55.55 5.46,55.55 6.73,54.28 JP2.7 | JP1.30 3.77,50.47 5.46,50.47 6.73,49.2 JP2.11 | JP1.20 3.77,37.77 5.46,37.77 6.73,36.5 JP2.21 | JP1.14 3.77,30.15 5.46,30.15 6.73,28.88 JP2.27 | JP1.6 3.77,19.99 5.46,19.99 6.73,18.72 JP2.35
  Top 0.305: U1.4 v63.2,70.3 | v62,75.9 62.1,76 C1.2 C4.2 | C2.2 C3.2 v73.1,76 | J12.4 12.82,4.58 v13,4.75 | J10.7 26.1,4.6 v26.25,4.75 | J11.7 38.6,4.5 v39.5,4.5 | J13.4 47.95,4.5 v49,4.5
  other vias: 76,72 71.75,80 87,77 96,77 107,77 7,71.75 8.25,11 7.75,1.5 12.75,1.5 17.25,1.5 25.75,1.5 30.5,1.5 39.25,1.5 43.5,1.5 48.5,1.5 51,1.5 95.25,70 95.5,61 95.5,52.75 95.5,45 95.5,37.25 95.5,29 95.5,20.75 95.75,13 95.75,5.5 34.25,70 75,69 53.75,70 19.75,68 18.25,70.75 13,68 67.75,76.75
  pour Top: -5,94 128,94 134,88 134,0 128,-6 -4,-6 -12,2 -12,87
  pour Route2: -4,93 129,93 135,87 135,-1 129,-7 -3,-7 -11,1 -11,86
  pour Route15: -3,92 130,92 136,86 136,-2 130,-8 -2,-8 -10,0 -10,85
  pour Bottom: -2,91 131,91 137,85 137,-3 131,-9 -1,-9 -9,-1 -9,84
GPIO2
  Top 0.203: JP1.7 6.3,20 9.93,20 JP2.34
GPIO3
  Top 0.203: JP1.11 6.38,25 9.85,25 JP2.30
GPIO4
  Top 0.203: JP1.13 6.32,27.6 9.91,27.6 JP2.28
GPIO5
  Top 0.203: JP1.15 6.36,30.1 9.87,30.1 JP2.26
GPIO10
  Top 0.203: JP1.29 6.34,47.9 9.89,47.9 JP2.12
GPIO12
  Top 0.203: JP1.33 6.32,53 9.91,53 JP2.8
GPIO13
  Top 0.203: JP1.35 6.36,55.5 9.87,55.5 JP2.6
GPIO17
  Top 0.203: JP1.12 3.77,27.61 5.46,27.61 6.73,26.34 JP2.29
GPIO24
  Top 0.203: JP1.32 3.77,53.01 5.46,53.01 6.73,51.74 JP2.9
GPIO25
  Top 0.203: JP1.36 3.77,58.09 5.46,58.09 6.73,56.82 JP2.5
GPIO26
  Top 0.203: JP1.38 3.77,60.63 5.46,60.63 6.73,59.36 JP2.3
GPIO27
  Top 0.203: JP1.40 3.8,63.2 7.35,63.2 JP2.1
MISO1  (via drill 0.35)
  Top 0.152: J11.2 32.25,8.25 31.75,8.75 26.5,8.75 22.5,12.75 22.5,37.75 v22,38.25
  Top 0.203: JP1.21 6.28,37.8 9.95,37.8 JP2.20
  Bottom 0.152: v22,38.25 21.21,39.04 JP2.20
MISO2  (via drill 0.35)
  Top 0.152: J10.2 19,6.2 18.5,6.7 18.5,30.75 v17.25,32
  Top 0.203: JP2.23 6.73,33.96 5.46,35.23 3.67,35.23 2.5,34.06 JP1.18
  Bottom 0.152: v17.25,32 12.5,32 11.75,32.75 9.86,32.75 JP2.23
MOSI1  (via drill 0.35)
  Top 0.152: J11.1 31,6.75 30,7.75 26.5,7.75 21.75,12.5 21.75,35.75 v21.25,36.25
  Top 0.203: JP1.19 6.34,35.2 9.89,35.2 JP2.22
  Bottom 0.152: v21.25,36.25 21,36.5 JP2.22
MOSI2  (via drill 0.35)
  Top 0.152: J10.1 17.75,30 v14.75,33
  Top 0.203: JP2.19 6.73,39.04 5.46,40.31 3.77,40.31 2.75,39.29 JP1.22
  Bottom 0.152: v14.75,33 12.5,35.25 10.5,35.25 9.9,35.85 9.9,37.79 JP2.19
SCK1  (via drill 0.35)
  Top 0.152: J11.3 33.5,8.75 32.5,9.75 26.5,9.75 23.5,12.75 23.5,39.25 v23,39.75
  Top 0.203: JP2.18 9.91,40.3 6.32,40.3 JP1.23
  Bottom 0.152: v23,39.75 22.5,40.25 12.52,40.25 JP2.18
SCK2  (via drill 0.35)
  Top 0.152: J10.3 20.25,6.25 19.7,6.8 19.7,49.95 v20,50.25
  Top 0.203: JP1.31 6.28,50.5 9.95,50.5 JP2.10
  Bottom 0.152: v20,50.25 18.51,51.74 JP2.10
SCL1  (via drill 0.35)
  Top 0.152: JP2.36 12.75,17.16 12.75,11.25 9.62,8.12 J12.2
  Top 0.203: JP1.5 6.24,17.52 9.99,17.52 JP2.36 | R6.1 v5.5,4 | v9.65,3.18 9.65,4.55 J12.2
  Bottom 0.203: v5.5,4 5.52,3.98 8.85,3.98 v9.65,3.18
SCL_3V3  (via drill 0.35)
  Top 0.203: JP1.28 3.77,47.93 5.46,47.93 6.73,46.66 JP2.13
  Top 0.305: U1.3 64.7,71.66 59.4,71.66 | R2.1 59.4,71.66 | 59.4,71.66 21.16,71.66 17.75,68.25 17.75,49.5 v15,46.75
  Bottom 0.305: v15,46.75 13.75,45.5 9.81,45.5 JP2.13
SCL_5V
  Top 0.305: U1.6 71.2,71.56 72.2,70.56 77.8,70.56 | 77.8,70.56 83.56,70.56 88.5,75.5 112.9,75.5 113.78,76.38 J9.1 | R4.1 77.8,70.56
SDA1  (via drill 0.35)
  Top 0.152: JP2.38 12.25,15.12 12.25,12.25 8.38,8.38 J12.1
  Top 0.203: JP1.3 6.22,15 10.01,15 JP2.38 | R5.1 5.25,1.75 v5.3,1.8 | v8.4,3.2 8.38,3.23 J12.1
  Bottom 0.203: v5.3,1.8 7,1.8 v8.4,3.2
SDA_3V3
  Top 0.203: JP1.27 6.3,45.4 9.93,45.4 JP2.14
  Top 0.305: U1.2 64.73,72.9 59.4,72.9 | 59.4,72.9 18.65,72.9 15.65,69.9 15.65,48.9 13.41,46.66 JP2.14 | R1.1 59.4,72.9
SDA_5V
  Top 0.305: U1.7 71.2,72.83 72.2,73.83 77.8,73.83 | 77.8,73.83 82.18,73.83 86.87,78.53 112.75,78.53 113.66,77.62 J9.2 | R3.1 77.8,73.83
UART_RX  (via drill 0.35)
  Top 0.152: v41.75,8.75 43.5,8.75 45.38,6.88 J13.2
  Top 0.203: JP2.31 6.73,23.8 5.46,25.07 3.67,25.07 2.5,23.9 JP1.10
  Bottom 0.152: JP2.31 9.95,22.5 12.25,22.5 26,8.75 v41.75,8.75
UART_TX  (via drill 0.35)
  Top 0.152: v41.75,7.5 43,7.5 44.12,6.38 J13.1
  Top 0.203: JP1.8 3.77,22.53 5.46,22.53 6.73,21.26 JP2.33
  Bottom 0.152: JP2.33 9.91,20 13,20 25.5,7.5 v41.75,7.5
(copper drawn outside any net)
  shapes: Top area x1131

### Text on the board
tPlace: SDA / SCL | I2C | H L | H L | H L | H L | CAN | 0 1 2 3 4 5 6 7 | 0 1 2 3 4 5 6 7 | H L | H L | H L | I2C1 | SPI1 | SPI0 | UART | RoboDesign Lab / UP Xtreme Port Adapter v1.0 | H L | SDA1 / SCL1 / 3V3 / GND | MOSI / MISO / SCK / CS0 / CS1 / 3V3 / GND | MOSI / MISO / SCK / CS0 / CS1 / 3V3 / GND | TX / RX / 3V3 / GND
bPlace: SDA / SCL | H L | H L | H L | H L | H L | H L | H L | H L